# EasyEDA Pro project ProDoc_三路驱动V4.0_2025-09-29.epro

# Schematic Schematic4_3
Board Name: 三路驱动V4.0; Create Date: 2025-07-02; Page Name: P1; Project Name: 智能车竞赛2025; Schematic Name: Schematic4_3; Update Date: 2025-07-02; Company: 嘉立创EDA; Page Size: A4; Version: V1.0
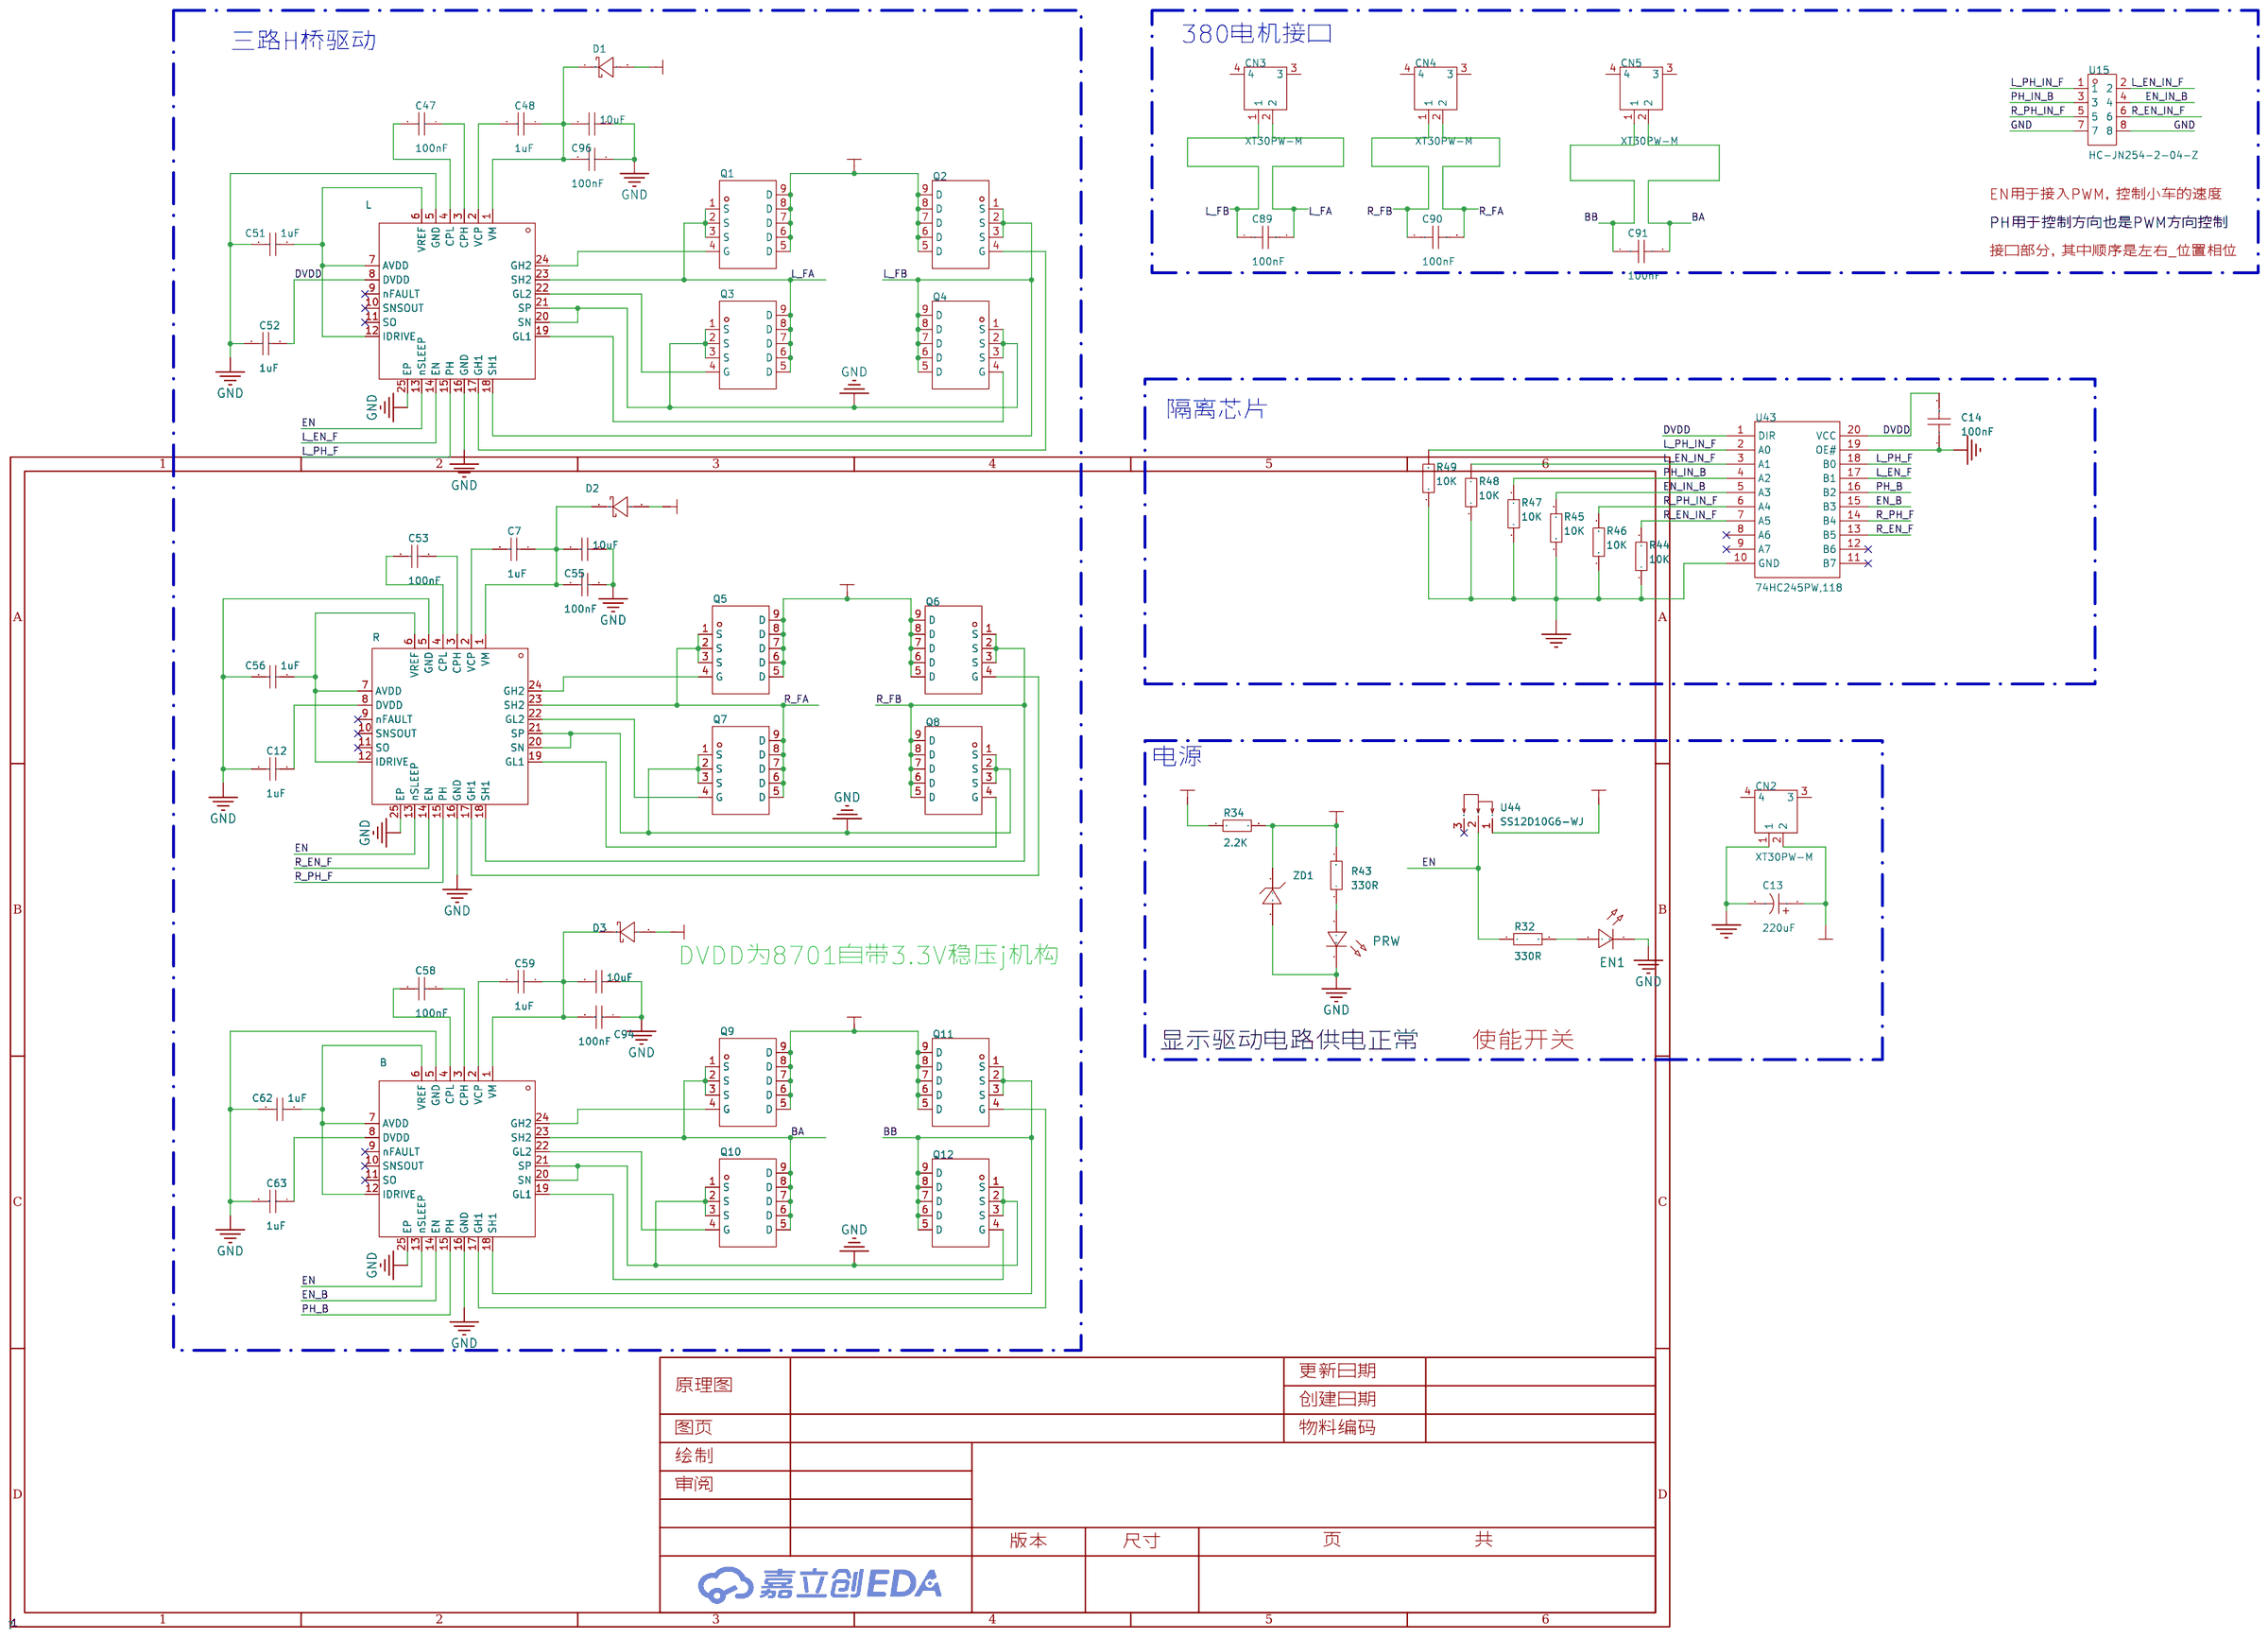
[diagram p0: schematic sheet]

## Parts
B  DRV8701ERGET  [VQFN-24_L4.0-W4.0-P0.50-LS4.0-BL-EP]
C7  1uF  [C0603]
C12  1uF  [C0603]
C13  220uF  [CAP-TH_BD8.0-P3.50-D0.5-FD]
C14  100nF  [C0603]
C47  100nF  [C0603]
C48  1uF  [C0603]
C51  1uF  [C0603]
C52  1uF  [c0603]
C53  100nF  [C0603]
C54  10uF  [C0603]
C55  100nF  [C0603]
C56  1uF  [C0603]
C58  100nF  [C0603]
C59  1uF  [C0603]
C62  1uF  [C0603]
C63  1uF  [C0603]
C89  100nF  [C0805]
C90  100nF  [C0805]
C91  100nF  [C0805]
C93  10uF  [C0603]
C94  100nF  [C0603]
C95  10uF  [C0603]
C96  100nF  [C0603]
CN2  XT30PW-M  [CONN-TH_XT30PW-M]
CN3  XT30PW-M  [CONN-TH_XT30PW-M]
CN4  XT30PW-M  [CONN-TH_XT30PW-M]
CN5  XT30PW-M  [CONN-TH_XT30PW-M]
D1  1N5819WS  [SOD-323_L1.6-W1.3-LS2.7-RD]
D2  1N5819WS  [SOD-323_L1.6-W1.3-LS2.7-RD]
D3  1N5819WS  [SOD-323_L1.6-W1.3-LS2.7-RD]
EN1  -  [LED0805-RD_BLUE]
L  DRV8701ERGET  [VQFN-24_L4.0-W4.0-P0.50-LS4.0-BL-EP]
PRW  -  [LED0805-RD_BLUE]
Q1  TPH1R403NL  [DSOP-8_L5.0-W5.0-P1.27-LS6.0-BL-EP]
Q2  TPH1R403NL  [DSOP-8_L5.0-W5.0-P1.27-LS6.0-BL-EP]
Q3  TPH1R403NL  [DSOP-8_L5.0-W5.0-P1.27-LS6.0-BL-EP]
Q4  TPH1R403NL  [DSOP-8_L5.0-W5.0-P1.27-LS6.0-BL-EP]
Q5  TPH1R403NL  [DSOP-8_L5.0-W5.0-P1.27-LS6.0-BL-EP]
Q6  TPH1R403NL  [DSOP-8_L5.0-W5.0-P1.27-LS6.0-BL-EP]
Q7  TPH1R403NL  [DSOP-8_L5.0-W5.0-P1.27-LS6.0-BL-EP]
Q8  TPH1R403NL  [DSOP-8_L5.0-W5.0-P1.27-LS6.0-BL-EP]
Q9  TPH1R403NL  [DSOP-8_L5.0-W5.0-P1.27-LS6.0-BL-EP]
Q10  TPH1R403NL  [DSOP-8_L5.0-W5.0-P1.27-LS6.0-BL-EP]
Q11  TPH1R403NL  [DSOP-8_L5.0-W5.0-P1.27-LS6.0-BL-EP]
Q12  TPH1R403NL  [DSOP-8_L5.0-W5.0-P1.27-LS6.0-BL-EP]
R  DRV8701ERGET  [VQFN-24_L4.0-W4.0-P0.50-LS4.0-BL-EP]
R32  330R  [R0805]
R34  2.2K  [R0805]
R43  330R  [R0805]
R44  10K  [R0603]
R45  10K  [R0603]
R46  10K  [R0603]
R47  10K  [R0603]
R48  10K  [R0603]
R49  10K  [R0603]
U15  HC-JN254-2-04-Z  [IDC-TH_8P-P2.54-V-R2-C4-S2.54]
U43  74HC245PW,118  [TSSOP-20_L6.5-W4.4-P0.65-LS6.4-BL]
U44  SS12D10G6-WJ  [SW-TH_3P-P4.80_HX-SS12D10G6-WJ]
ZD1  BZT52C3V3  [SOD-123_L2.8-W1.8-LS3.7-RD]

## Library data of the parts
B L R = DRV8701ERGET: DRV8701 DRV8701 H 桥栅极驱动器; Supplier Part: C132049; Manufacturer: TI(德州仪器); Supplier Footprint: VQFN-24; JLCPCB Part Class: 扩展库; Datasheet: https://atta.szlcsc.com/upload/public/pdf/source/20170925/C132049_1506321643935990409.pdf; Supplier: LCSC
C7 C12 C47 C48 C51-C56 C58 C59 C62 C63 C93-C96 = CC0805KRX7R9BB104: 容值:100nF;精度:±10%;额定电压:50V;温度系数:X7R;; LCSC Part Name: 100nF ±10% 50V; Supplier Part: C49678; Manufacturer: YAGEO(国巨); Supplier Footprint: 0805; JLCPCB Part Class: Basic Part; Datasheet: https://atta.szlcsc.com/upload/public/pdf/source/20151026/1457707504898.pdf; Supplier: LCSC; Tolerance: ±10%; Voltage Rated: 50V; Temperature Coefficient: X7R
C13 = 01EC1230: 容值:220uF;精度:±20%;额定电压:35V;纹波电流:280mA@120kHz;等效串联电阻:-;; LCSC Part Name: 220uF ±20% 35V; Supplier Part: C2831783; Manufacturer: KNSCHA(科尼盛); Supplier Footprint: 插件,D8xL12mm; JLCPCB Part Class: 扩展库; Datasheet: https://atta.szlcsc.com/upload/public/pdf/source/20210507/C2831783_57665407C268EE999E0BAC2FD481F51A.pdf; Supplier: LCSC; Tolerance: ±20%; Rated Voltage: 35V; Ripple Current: 280mA@120kHz; Lead Spacing: 3.5mm; φD: 8mm; L: 12mm; Lifetime @ Temp: 2000hrs@105℃; Operating Temperature: -40℃~+105℃
C14 = CAP_0603: Supplier Footprint: 0603
C89-C91 = CAP_0805: Supplier Footprint: 0805
CN2-CN5 = XT30PW-M: 类别:-;类型1:-;; LCSC Part Name: AMASS(艾迈斯)航模插头 卧式弯脚 XT30PW-M公头; Supplier Part: C431092; Manufacturer: AMASS(艾迈斯); JLCPCB Part Class: 扩展库; Datasheet: https://atta.szlcsc.com/upload/public/pdf/source/20220222/6A9F22F7850E25B33E1BE430ADF8560B.pdf; Supplier: LCSC; Brand: 艾迈斯; Type: 航模插头; RatedVoltage: DC 500V; InterfaceType: 公头; RatedCurrent: 15A; RecommendedWireGauge: 16/18/20AWG; contact resistance: 1.2mΩ; specifications: 2pin
D1-D3 = 1N5819WS_C1884554: 二极管配置:独立式;直流反向耐压(Vr):40V;平均整流电流(Io):-;正向压降(Vf):600mV@200mA;反向电流(Ir):5A@30V;; LCSC Part Name: 40V 600mV@200mA; Supplier Part: C1884554; Manufacturer: YFW佑风微; Supplier Footprint: SOD-323; JLCPCB Part Class: 扩展库; Datasheet: https://atta.szlcsc.com/upload/public/pdf/source/20210111/C1884554_4EBD9497399E51FFCDCB2BD4F6DDA6EC.pdf; Supplier: LCSC; Diode Configuration: 独立式; Reverse Voltage (Vr): 40V; Forward Voltage (Vf@If): 600mV@200mA; Reverse Leakage Current (Ir): 5A@30V
EN1 PRW = LED_0603-R: 发光颜色:红灯;二极管配置:-;透镜颜色:无色透明;主波长:617.5nm;峰值波长:632nm;色温:-;光通量(25时):-;测试电流:5mA;正向电压(VF):2.2V;发光强度:28.5mcd;功率:60mW;发光角度:120°;安装方式:-;工作温度:-40~+85;; Supplier Footprint: 0603; Supplier Part: C72044
Q1-Q12 = TPH1R403NL_C83440: 类型:N沟道;漏源电压(Vdss):30V;连续漏极电流(Id):150A;功率(Pd):64W;导通电阻(RDS(on)@Vgs,Id):1.4mΩ@10V,30A;阈值电压(Vgs(th)@Id):2.3V@500A;; LCSC Part Name: N沟道 30V 150A; Supplier Part: C83440; Manufacturer: TOSHIBA(东芝); Supplier Footprint: SOP Advance; JLCPCB Part Class: 扩展库; Datasheet: https://atta.szlcsc.com/upload/public/pdf/source/20170908/C83440_1504870121708958077.pdf; Supplier: LCSC; Type: N沟道; Drain Source Voltage (Vdss): 30V; Continuous Drain Current (Id): 150A; Power Dissipation (Pd): 64W; Drain Source On Resistance (RDS(on)@Vgs,Id): 1.4mΩ@10V,30A; Gate Threshold Voltage (Vgs(th)@Id): 2.3V@500A
R32 R34 R43-R49 = Res_0603: Supplier Footprint: 0603
U15 = HC-JN254-2-04-Z: 连接器类型:简牛座;间距:2.54mm;结构:2x4P;额定电流:3A;额定电压:-;封装形式:直插;行距:2.54mm;排数:2;每排PIN数:4;触头材质:黄铜;触头镀层:金;工作温度范围:-40℃~+105℃;焊接温度(最大值):260℃@10S;; LCSC Part Name: 2.54mm 2x4P 排数:2 每排P数:4; Supplier Part: C5372864; Manufacturer: HCTL(华灿天禄); Supplier Footprint: 插件,P=2.54mm; JLCPCB Part Class: 扩展库; Datasheet: https://atta.szlcsc.com/upload/public/pdf/source/20230314/29278A24539954283B80828B9C32CD4C.pdf; Supplier: LCSC; Connector Type: 简牛座; Pitch: 2.54mm; Structure: 2x4P; Current Rating (Max): 3A; Holder Type: 直插; Row Spacing: 2.54mm; Number of Rows: 2; Pin Number in each Row: 4; Contact Material: 黄铜; Contact Plating: 金; Operating Temperature Range: -40℃~+105℃; Soldering Temperature(Max): 260℃@10S
U43 = 74HC245PW,118: 输入类型:-;电源电压:2V~6V;元件数:1;每个元件位数:8;灌电流(IOL):7.8mA;拉电流(IOH):7.8mA;; Supplier Part: C5626; Manufacturer: Nexperia(安世); Supplier Footprint: TSSOP-20; JLCPCB Part Class: 扩展库; Datasheet: https://atta.szlcsc.com/upload/public/pdf/source/20240724/EDC8C45902BA97AEC59E8811E3964917.pdf; Supplier: LCSC; output type: 三态; Supply Voltage: 2V~6V; Number of Elements: 1; Number of Bits per Element: 8; Sink Current: 7.8mA; Source Current: 7.8mA; Logic Family: 74HC; Operating Temperature: -40℃~+125℃
U44 = SS12D10G6-WJ: 电路结构:单刀双掷;安装方式:弯插;开关颜色:黑色;额定电流:2A;额定电压:125V;工作寿命:3千次;; LCSC Part Name: 两档卧式插件 3脚拨动开关弯插 柄长6.0mm; Supplier Part: C7431059; Manufacturer: SHOU HAN(首韩); Supplier Footprint: 插件; JLCPCB Part Class: 扩展库; Datasheet: https://atta.szlcsc.com/upload/public/pdf/source/20240716/65906E925F6A30FB5BD71C0F2E575DBB.pdf; Supplier: LCSC; Circuit: 单刀双掷; Actuator Style: 矩形柱状; Termination Style: PC引脚; Length: 12.7mm; Width: 6.7mm; Switch Height: 12.4mm; Mounting Type: 弯插; Actuator Color: 黑色; Current Rating: 2A; Voltage Rating: 125V; Life: 3千次; Operating Temperature: -25℃~+70℃
ZD1 = BZT52C3V3_C2112: 二极管配置:独立式;稳压值(标称值):3.3V;稳压值(范围):3.1V~3.5V;精度:-;功率:350mW;反向电流(Ir):5A@1V;阻抗(Zzt):95Ω;; LCSC Part Name: 3.3V 350mW; Supplier Part: C2112; Manufacturer: CJ（江苏长电/长晶）; Supplier Footprint: SOD-123; JLCPCB Part Class: 扩展库; Datasheet: https://atta.szlcsc.com/upload/public/pdf/source/20170919/C2112_1505799672426977594.pdf; Supplier: LCSC; Diode Configuration: 独立式; Zener Voltage (Nom): 3.3V; Zener Voltage (Range): 3.1V~3.5V; Power Dissipation: 350mW; Reverse Leakage Current (Ir): 5A@1V; Zener Impedance (Zzt): 95Ω

## Nets
3.3V: R34.2 R43.2 U44.1 ZD1.1(K)
DVDD: C14.2 C52.1 L.8(DVDD) U43.1(DIR) U43.20(VCC)
GND: B.5(GND) B.16(GND) B.20(SN) B.21(SP) B.25(EP) C12.2 C13.2 C14.1 C51.2 C52.2 C54.1 C55.1 C56.2 C62.2 C63.2 C93.1 C94.1 C95.1 C96.1 CN2.1 EN1.1(C) L.5(GND) L.16(GND) L.20(SN) L.21(SP) L.25(EP) PRW.1(C) Q3.1(S) Q3.2(S) Q3.3(S) Q4.1(S) Q4.2(S) Q4.3(S) Q7.1(S) Q7.2(S) Q7.3(S) Q8.1(S) Q8.2(S) Q8.3(S) Q10.1(S) Q10.2(S) Q10.3(S) Q12.1(S) Q12.2(S) Q12.3(S) R.5(GND) R.16(GND) R.20(SN) R.21(SP) R.25(EP) R44.1 R45.1 R46.1 R47.1 R48.1 R49.1 U15.7 U15.8 U43.10(GND) U43.19(OE#) ZD1.2(A)
VIN: C13.1 CN2.2 D1.2(A) D2.2(A) D3.2(A) Q1.5(D) Q1.6(D) Q1.7(D) Q1.8(D) Q1.9(D) Q2.5(D) Q2.6(D) Q2.7(D) Q2.8(D) Q2.9(D) Q5.5(D) Q5.6(D) Q5.7(D) Q5.8(D) Q5.9(D) Q6.5(D) Q6.6(D) Q6.7(D) Q6.8(D) Q6.9(D) Q9.5(D) Q9.6(D) Q9.7(D) Q9.8(D) Q9.9(D) Q11.5(D) Q11.6(D) Q11.7(D) Q11.8(D) Q11.9(D) R34.1
BA: B.23(SH2) C91.2 CN5.2 Q9.1(S) Q9.2(S) Q9.3(S) Q10.5(D) Q10.6(D) Q10.7(D) Q10.8(D) Q10.9(D)
BB: B.18(SH1) C91.1 CN5.1 Q11.1(S) Q11.2(S) Q11.3(S) Q12.5(D) Q12.6(D) Q12.7(D) Q12.8(D) Q12.9(D)
EN: B.13(nSLEEP) L.13(nSLEEP) R.13(nSLEEP) R32.1 U44.2
EN_B: B.14(EN) U43.15(B3)
EN_IN_B: R45.2 U15.4 U43.5(A3)
L_EN_F: L.14(EN) U43.17(B1)
L_EN_IN_F: R48.2 U15.2 U43.3(A1)
L_FA: C89.2 CN3.2 L.23(SH2) Q1.1(S) Q1.2(S) Q1.3(S) Q3.5(D) Q3.6(D) Q3.7(D) Q3.8(D) Q3.9(D)
L_FB: C89.1 CN3.1 L.18(SH1) Q2.1(S) Q2.2(S) Q2.3(S) Q4.5(D) Q4.6(D) Q4.7(D) Q4.8(D) Q4.9(D)
L_PH_F: L.15(PH) U43.18(B0)
L_PH_IN_F: R49.2 U15.1 U43.2(A0)
PH_B: B.15(PH) U43.16(B2)
PH_IN_B: R47.2 U15.3 U43.4(A2)
R_EN_F: R.14(EN) U43.13(B5)
R_EN_IN_F: R44.2 U15.6 U43.7(A5)
R_FA: C90.2 CN4.2 Q5.1(S) Q5.2(S) Q5.3(S) Q7.5(D) Q7.6(D) Q7.7(D) Q7.8(D) Q7.9(D) R.23(SH2)
R_FB: C90.1 CN4.1 Q6.1(S) Q6.2(S) Q6.3(S) Q8.5(D) Q8.6(D) Q8.7(D) Q8.8(D) Q8.9(D) R.18(SH1)
R_PH_F: R.15(PH) U43.14(B4)
R_PH_IN_F: R46.2 U15.5 U43.6(A4)
$1N4660: L.22(GL2) Q3.4(G)
$1N4661: L.24(GH2) Q1.4(G)
$1N4662: C48.2 L.2(VCP)
$1N4663: C47.2 L.4(CPL)
$1N4675: C51.1 L.6(VREF) L.7(AVDD) L.12(IDRIVE)
$1N4676: C47.1 L.3(CPH)
$1N4680: L.19(GL1) Q4.4(G)
$1N4681: L.17(GH1) Q2.4(G)
$1N4684: C7.2 R.2(VCP)
$1N4685: C53.2 R.4(CPL)
$1N4694: C56.1 R.6(VREF) R.7(AVDD) R.12(IDRIVE)
$1N4695: C53.1 R.3(CPH)
$1N4699: Q8.4(G) R.19(GL1)
$1N4700: Q6.4(G) R.17(GH1)
$1N4703: C12.1 R.8(DVDD)
$1N4708: B.22(GL2) Q10.4(G)
$1N4709: B.24(GH2) Q9.4(G)
$1N4710: B.2(VCP) C59.2
$1N4711: B.4(CPL) C58.2
$1N4721: B.8(DVDD) C63.1
$1N4722: B.6(VREF) B.7(AVDD) B.12(IDRIVE) C62.1
$1N4723: B.3(CPH) C58.1
$1N4727: B.19(GL1) Q12.4(G)
$1N4728: B.17(GH1) Q11.4(G)
$1N4802: Q5.4(G) R.24(GH2)
$1N4803: Q7.4(G) R.22(GL2)
$1N4806: EN1.2(A) R32.2
$1N4831: B.1(VM) C59.1 C93.2 C94.2 D3.1(C)
$1N4840: C48.1 C95.2 C96.2 D1.1(C) L.1(VM)
$1N4841: C7.1 C54.2 C55.2 D2.1(C) R.1(VM)
$1N5410: PRW.2(A) R43.1

Not connected (* = marked no-connect by the designer): B 9(nFAULT)* 10(SNSOUT)* 11(SO)*; CN2 3 4; CN3 3 4; CN4 3 4; CN5 3 4; L 9(nFAULT)* 10(SNSOUT)* 11(SO)*; R 9(nFAULT)* 10(SNSOUT)* 11(SO)*; U43 8(A6)* 9(A7)* 11(B7)* 12(B6)*; U44 3*

## Notes on the sheet
- 380电机接口
- 三路H桥驱动
- EN用于接入PWM，控制小车的速度
- PH用于控制方向也是PWM方向控制
- 接口部分，其中顺序是左右_位置相位
- 隔离芯片
- 电源
- DVDD为8701自带3.3V稳压j机构
- 显示驱动电路供电正常
- 使能开关

# Board PCB5_3
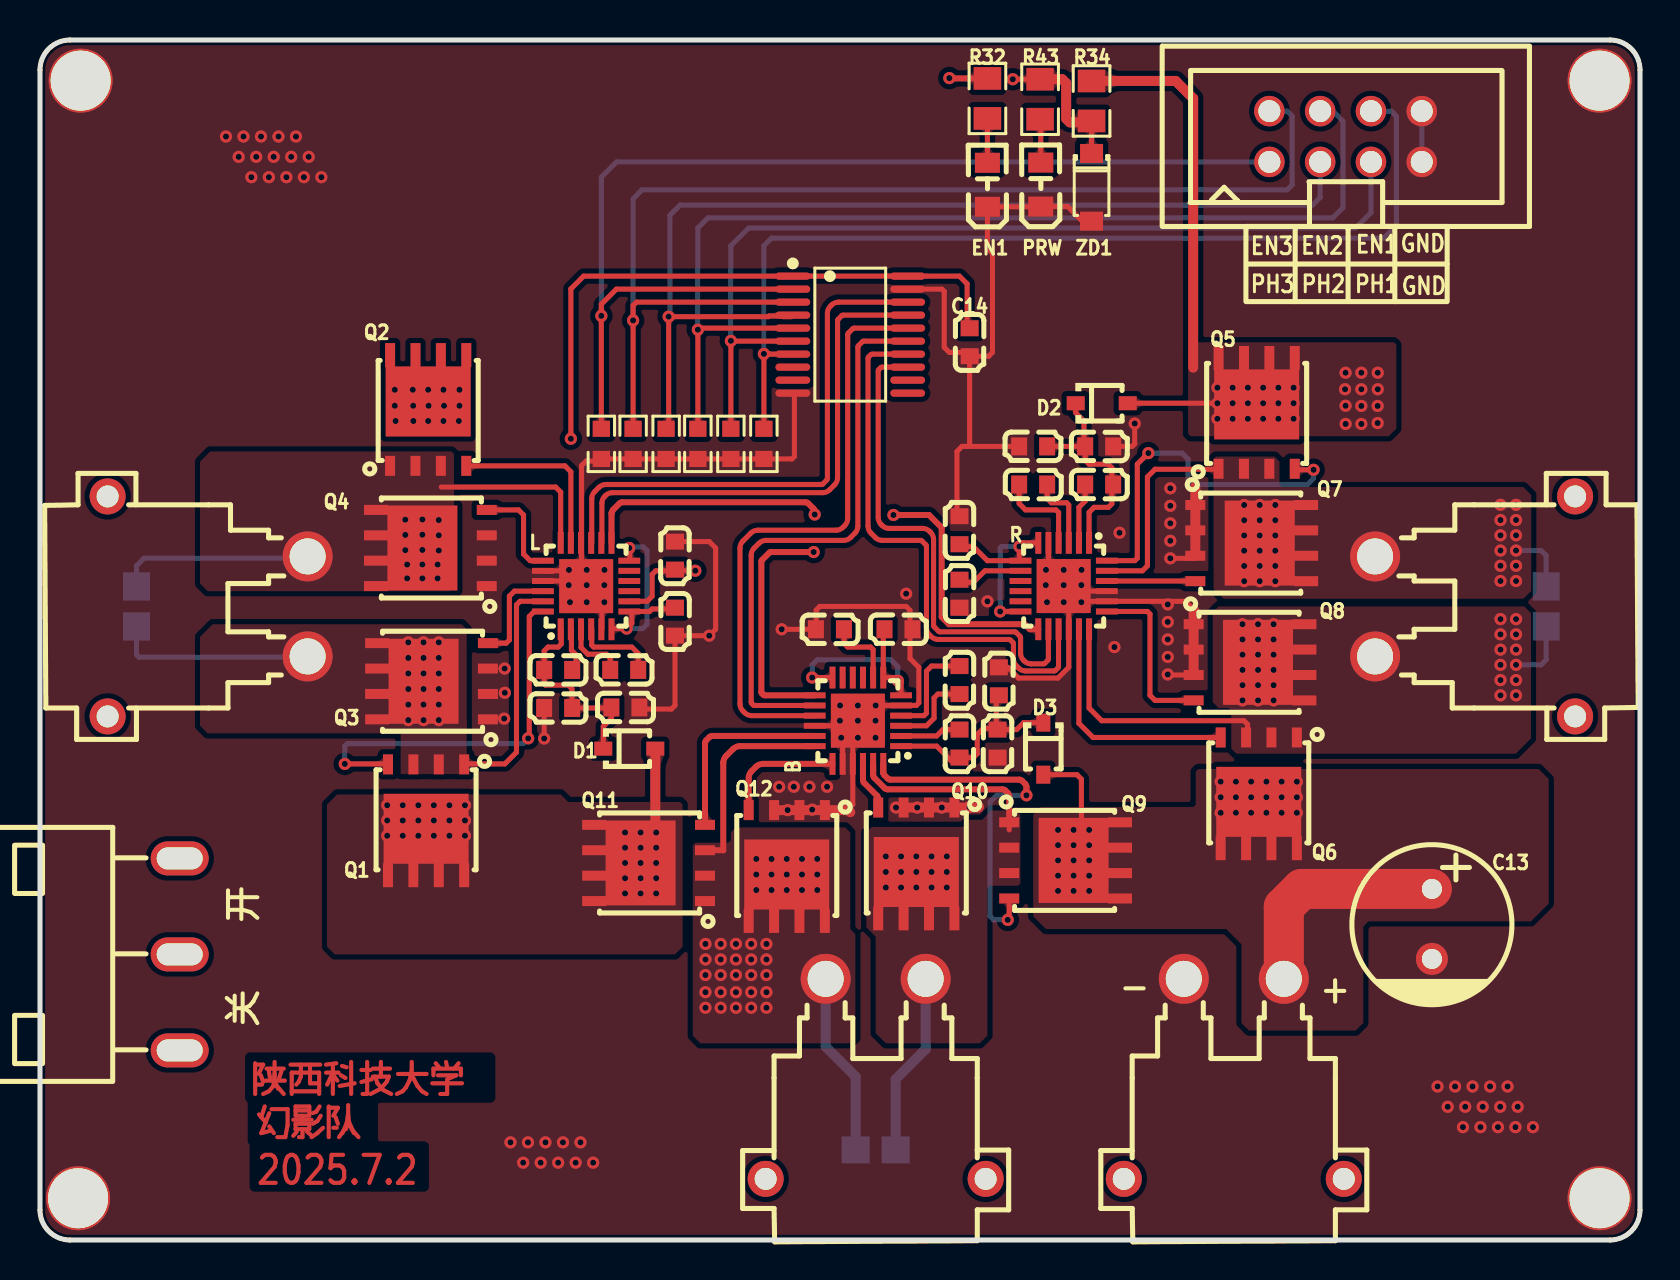
[diagram p1: board, top side]
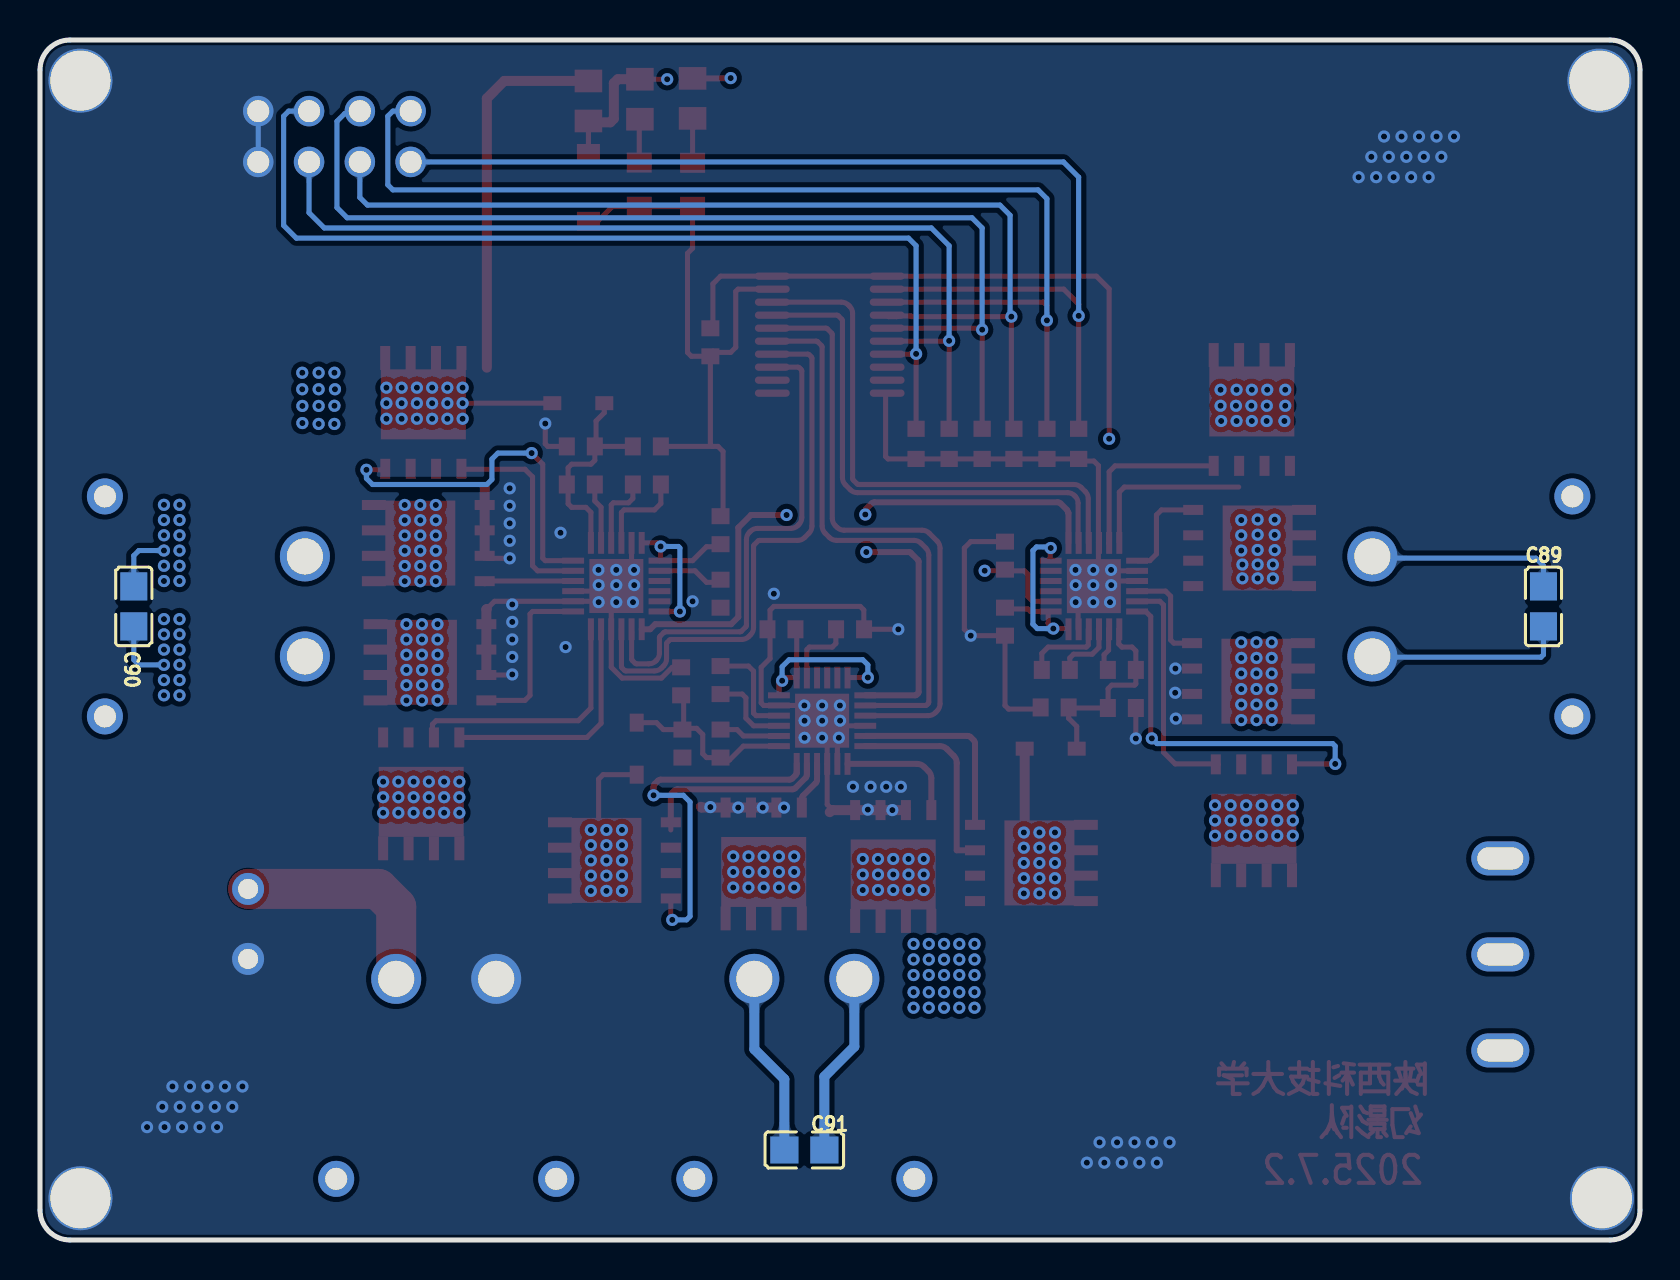
[diagram p2: board, bottom side, seen from below]

Outline 80 x 60 mm; copper layers: Top Layer, Inner1, Inner2, Bottom Layer. Coordinates in mm from the lower left corner of the outline.
Outline path: 0,58.5 0,1.5 arc(0.44,0.44) 1.5,0 78.5,0 arc(79.56,0.44) 80,1.5 80,58.5 arc(79.56,59.56) 78.5,60 1.5,60 arc(0.44,59.56) 0,58.5
Stack: Top Layer 0.035mm 外层铜厚1oz / Dielectric1 0.2104mm 7628 RC49% 8.6mil / Inner1 0.0152mm 内层铜厚 / Dielectric2 1.065mm 1.1mm H/HOZ Copper / Inner2 0.0152mm 内层铜厚 / Dielectric3 0.2104mm 7628 RC49% 8.6mil / Bottom Layer 0.035mm 外层铜厚1oz

## Design rules (mm)
template: 自定义配置
spacing copperThickness1oz (default): track to track 0.102, other pairs 0.152 to 0.3
spacing copperThickness2oz: track to track 0.203, other pairs 0.152 to 0.3
track width copperThickness1oz (default): min 0.127, default 0.254, max 5
track width copperThickness2oz: min 0.203, default 0.254, max 2.54
differential pair differentialPair (default): width min 0.127, default 0.254, max 2.54; gap min 0.152, default 0.152
via viaSize (default): diameter min 0.5, default 0.61, max 10; hole min 0.3, default 0.305, max 6.3

## Placement (name value [footprint] x y rotation side)
B  DRV8701ERGET  [VQFN-24_L4.0-W4.0-P0.50-LS4.0-BL-EP]  40.89 25.96 90 top
C7  1uF  [C0603]  52.96 37.78 180 top
C12  1uF  [C0603]  45.97 32.31 270 top
C13  220uF  [CAP-TH_BD8.0-P3.50-D0.5-FD]  69.6 15.8 270 top
C14  100nF  [C0603]  46.48 44.89 90 top
C47  100nF  [C0603]  29.21 28.5 0 top
C48  1uF  [C0603]  25.91 28.5 0 top
C51  1uF  [C0603]  31.75 30.92 270 top
C52  1uF  [c0603]  31.75 34.22 90 top
C53  100nF  [C0603]  49.66 37.78 180 top
C54  10uF  [C0603]  49.66 39.68 0 top
C55  100nF  [C0603]  52.96 39.68 180 top
C56  1uF  [C0603]  45.97 35.49 90 top
C58  100nF  [C0603]  45.97 28 90 top
C59  1uF  [C0603]  45.97 24.82 90 top
C62  1uF  [C0603]  42.93 30.54 0 top
C63  1uF  [C0603]  39.5 30.54 180 top
C89  100nF  [C0805]  4.83 31.68 270 bottom
C90  100nF  [C0805]  75.31 31.68 90 bottom
C91  100nF  [C0805]  41.78 4.5 0 bottom
C93  10uF  [C0603]  47.94 27.93 270 top
C94  100nF  [C0603]  47.88 24.82 90 top
C95  10uF  [C0603]  25.91 26.6 0 top
C96  100nF  [C0603]  29.27 26.63 180 top
CN2  XT30PW-M  [CONN-TH_XT30PW-M]  59.69 8.06 0 top
CN3  XT30PW-M  [CONN-TH_XT30PW-M]  8.38 31.68 270 top
CN4  XT30PW-M  [CONN-TH_XT30PW-M]  71.75 31.68 90 top
CN5  XT30PW-M  [CONN-TH_XT30PW-M]  41.78 8.06 0 top
D1  1N5819WS  [SOD-323_L1.6-W1.3-LS2.7-RD]  29.46 24.57 0 top
D2  1N5819WS  [SOD-323_L1.6-W1.3-LS2.7-RD]  53.09 41.84 0 top
D3  1N5819WS  [SOD-323_L1.6-W1.3-LS2.7-RD]  50.16 24.57 270 top
EN1  -  [LED0805-RD_BLUE]  47.37 52.76 90 top
L  DRV8701ERGET  [VQFN-24_L4.0-W4.0-P0.50-LS4.0-BL-EP]  27.31 32.69 0 top
NOREF  -  [Pad_e255]  77.98 57.97 0 top
NOREF#2  -  [Pad_e259]  2.03 57.97 0 top
NOREF#3  -  [Pad_e257]  77.98 2.09 0 top
NOREF#4  -  [Pad_e258]  1.91 2.09 0 top
PRW  -  [LED0805-RD_BLUE]  50.04 52.77 90 top
Q1  TPH1R403NL  [DSOP-8_L5.0-W5.0-P1.27-LS6.0-BL-EP]  19.3 21.01 180 top
Q2  TPH1R403NL  [DSOP-8_L5.0-W5.0-P1.27-LS6.0-BL-EP]  19.41 41.48 0 top
Q3  TPH1R403NL  [DSOP-8_L5.0-W5.0-P1.27-LS6.0-BL-EP]  19.63 27.94 90 top
Q4  TPH1R403NL  [DSOP-8_L5.0-W5.0-P1.27-LS6.0-BL-EP]  19.57 34.6 90 top
Q5  TPH1R403NL  [DSOP-8_L5.0-W5.0-P1.27-LS6.0-BL-EP]  60.83 41.33 0 top
Q6  TPH1R403NL  [DSOP-8_L5.0-W5.0-P1.27-LS6.0-BL-EP]  60.94 22.36 180 top
Q7  TPH1R403NL  [DSOP-8_L5.0-W5.0-P1.27-LS6.0-BL-EP]  60.54 34.85 270 top
Q8  TPH1R403NL  [DSOP-8_L5.0-W5.0-P1.27-LS6.0-BL-EP]  60.45 28.89 270 top
Q9  TPH1R403NL  [DSOP-8_L5.0-W5.0-P1.27-LS6.0-BL-EP]  51.23 18.98 270 top
Q10  TPH1R403NL  [DSOP-8_L5.0-W5.0-P1.27-LS6.0-BL-EP]  43.81 18.85 180 top
Q11  TPH1R403NL  [DSOP-8_L5.0-W5.0-P1.27-LS6.0-BL-EP]  30.48 18.85 90 top
Q12  TPH1R403NL  [DSOP-8_L5.0-W5.0-P1.27-LS6.0-BL-EP]  37.34 18.72 180 top
R  DRV8701ERGET  [VQFN-24_L4.0-W4.0-P0.50-LS4.0-BL-EP]  51.18 32.7 180 top
R32  330R  [R0805]  47.37 57.08 270 top
R34  2.2K  [R0805]  52.58 56.95 270 top
R43  330R  [R0805]  50 57.04 90 top
R44  10K  [R0603]  36.19 39.81 90 top
R45  10K  [R0603]  32.89 39.81 90 top
R46  10K  [R0603]  34.54 39.81 90 top
R47  10K  [R0603]  31.31 39.81 90 top
R48  10K  [R0603]  29.65 39.81 90 top
R49  10K  [R0603]  28.07 39.81 90 top
U15  HC-JN254-2-04-Z  [IDC-TH_8P-P2.54-V-R2-C4-S2.54]  65.28 55.17 0 top
U43  74HC245PW,118  [TSSOP-20_L6.5-W4.4-P0.65-LS6.4-BL]  40.51 45.27 270 top
U44  SS12D10G6-WJ  [SW-TH_3P-P4.80_HX-SS12D10G6-WJ]  6.98 14.28 270 top
ZD1  BZT52C3V3  [SOD-123_L2.8-W1.8-LS3.7-RD]  52.58 52.63 270 top

## Footprints (pads in the part's own frame, mm; a bottom-side part is the same pattern mirrored in y, then rotated)
c0603
  rect 0.8x0.9 smd: 1(-0.7,0) 2(0.7,0)
C0603
  rect 0.8x0.9 smd: 1(-0.7,0) 2(0.7,0)
C0805
  rect 1.41x1.35 smd: 1(-1,0) 2(1,0)
CAP-TH_BD8.0-P3.50-D0.5-FD
  round 1.6 hole 1: 1(-1.75,0) 2(1.75,0)
CONN-TH_XT30PW-M
  round 2.5 hole 1.8: 1(-2.5,5) 2(2.5,5)
  round 1.8 hole 1.1: 3(5.5,-5) 4(-5.5,-5)
DSOP-8_L5.0-W5.0-P1.27-LS6.0-BL-EP
  rect 0.5x1 smd: 1(-1.905,-2.77) 2(-0.635,-2.77) 3(0.634,-2.77) 4(1.905,-2.77)
  rect 0.5x1.2 smd: 5(1.905,2.77) 6(0.635,2.77) 7(-0.634,2.77) 8(-1.905,2.77)
  custom 4.25x3.5 smd: 9(0,0.45)
IDC-TH_8P-P2.54-V-R2-C4-S2.54
  round 1.524 hole 1.1: 1(-3.81,-1.27) 2(-3.81,1.27) 3(-1.27,-1.27) 4(-1.27,1.27) 5(1.27,-1.27) 6(1.27,1.27) 7(3.81,-1.27) 8(3.81,1.27)
LED0805-RD_BLUE
  rect 1x1.25 smd: 1(-1.1,0) 2(1.1,0)
Pad_e255
  round 3.2 hole 3: 1(0,0)
Pad_e257
  round 3.2 hole 3: 1(0,0)
Pad_e258
  round 3.2 hole 3: 1(0,0)
Pad_e259
  round 3.2 hole 3: 1(0,0)
R0603
  rect 0.806x0.864 smd: 1(-0.753,0) 2(0.753,0)
R0805
  rect 1.133x1.377 smd: 1(-1,0) 2(1,0)
SOD-123_L2.8-W1.8-LS3.7-RD
  rect 0.95x1.15 smd: 1(-1.692,0) 2(1.692,0)
SOD-323_L1.6-W1.3-LS2.7-RD
  rect 0.899x0.701 smd: 1(-1.3,0) 2(1.3,0)
SW-TH_3P-P4.80_HX-SS12D10G6-WJ
  oval 1.7x2.9 hole 1.1x2.3: 1(-4.8,0) 2(0,0) 3(4.8,0)
TSSOP-20_L6.5-W4.4-P0.65-LS6.4-BL
  oval 0.364x1.742 smd: 1(-2.925,-2.871) 2(-2.275,-2.871) 3(-1.625,-2.871) 4(-0.975,-2.871) 5(-0.325,-2.871) 6(0.325,-2.871) 7(0.975,-2.871) 8(1.625,-2.871) 9(2.275,-2.871) 10(2.925,-2.871) 11(2.925,2.871) 12(2.275,2.871) 13(1.625,2.871) 14(0.975,2.871) 15(0.325,2.871) 16(-0.325,2.871) 17(-0.975,2.871) 18(-1.625,2.871) 19(-2.275,2.871) 20(-2.925,2.871)
VQFN-24_L4.0-W4.0-P0.50-LS4.0-BL-EP
  rect 0.3x1.092 smd: 1(-1.27,-2.159) 2(-0.762,-2.159) 3(-0.254,-2.159) 4(0.254,-2.159) 5(0.762,-2.159) 6(1.27,-2.159) 13(1.27,2.159) 14(0.762,2.159) 15(0.254,2.159) 16(-0.254,2.159) 17(-0.762,2.159) 18(-1.27,2.159)
  rect 1.092x0.3 smd: 7(2.159,-1.27) 8(2.159,-0.762) 9(2.159,-0.254) 10(2.159,0.254) 11(2.159,0.762) 12(2.159,1.27) 19(-2.159,1.27) 20(-2.159,0.762) 21(-2.159,0.254) 22(-2.159,-0.254) 23(-2.159,-0.762) 24(-2.159,-1.27)
  rect 2.7x2.7 smd: 25(0.001,-0.002)

## Nets
As in the schematic, except:
GND: B.5 B.16 B.20 B.21 B.25 C12.2 C13.2 C14.1 C51.2 C52.2 C54.1 C55.1 C56.2 C62.2 C63.2 C93.1 C94.1 C95.1 C96.1 CN2.1 EN1.1 L.5 L.16 L.20 L.21 L.25 NOREF.1 NOREF#2.1 NOREF#3.1 NOREF#4.1 PRW.1 Q3.1 Q3.2 Q3.3 Q4.1 Q4.2 Q4.3 Q7.1 Q7.2 Q7.3 Q8.1 Q8.2 Q8.3 Q10.1 Q10.2 Q10.3 Q12.1 Q12.2 Q12.3 R.5 R.16 R.20 R.21 R.25 R44.1 R45.1 R46.1 R47.1 R48.1 R49.1 U15.7 U15.8 U43.10 U43.19 ZD1.2

Pads without a net: B 9 10 11; CN2 3 4; CN3 3 4; CN4 3 4; CN5 3 4; L 9 10 11; R 9 10 11; U43 8 9 11 12; U44 3

## Via types
v1: diameter 0.61, hole 0.305, Top Layer to Bottom Layer, 382 vias

## Routing (per net, layer and track width the routed paths; a pad name or vN(x,y) marks a point on that pad's centre or on a via; arc(x,y) is an arc through that point)
3.3V: length 89
  Top Layer w0.254: R34.2 ZD1.1 ; R43.2 v1(48.64,58.04)
  Top Layer w0.5: R43.2 51.11,58.04 51.31,57.84 51.31,56.06 51.49,55.88 52.51,55.88 R34.2
  Inner1 w0.254: U44.1 7.24,19.33 7.24,58.09 8,58.86 48.39,58.86 48.64,58.6 v1(48.64,58.04)
DVDD: length 46.9
  Top Layer w0.254: 46.35,45.84 46.35,47.81 45.97,48.19 U43.20 U43.1 27.18,48.19 26.54,47.55 v1(26.54,40.06) ; 29.49,31.94 30.36,31.94 30.61,32.19 30.61,33.28 30.79,33.46 31.69,33.46 31.75,33.52 31.81,33.46 v1(32.77,33.46)
  Inner1 w0.254: v1(26.54,40.06) 32.38,40.06 32.77,39.68 v1(32.77,33.46)
GND: length 139.7
  Top Layer w0.254: R.5 50.42,33.46 R.25 ; ZD1.2 52.11,50.94 51.38,51.67 PRW.1 50.03,51.66 EN1.1 47.37,49.59 47.62,49.33 47.62,44.38 47.43,44.19 C14.1 46.48,39.77 46.39,39.68 ; 27.08,32.95 27.08,38.72 27.31,38.95 27.96,38.95 R49.1 R48.1 R47.1 R45.1 R46.1 R44.1 37.6,39.05 37.72,39.17 37.72,42.27 U43.10 ; B.16 40.64,25.71 ; 26.79,31.89 v1(26.5,31.89) ; v1(52.08,33.51) 51.32,32.74 v1(51.19,32.74) ; C52.2 33.46,34.92 33.78,34.6 33.78,30.54 v1(33.46,30.22) C51.2 31.75,26.73 31.57,26.55 30.05,26.55 C96.1 ; 46.39,39.68 46.1,39.68 45.85,39.43 45.85,36.06 ; 46.39,39.68 48.96,39.68 ; 51.44,32.44 51.95,31.94 R.20 57.28,31.94 57.66,31.55 ; 51.44,32.44 R.16 51.44,28.64 50.9,28.1 48.93,28.1 48.39,28.63 C93.1 ; 51.44,32.44 R.21 ; C55.1 54.61,39.68 54.74,39.81 v1(54.74,40.82) ; B.20 40.13,25.04 v1(40.06,25.11) 40.35,25.11 40.64,24.82 B.21 40.64,21.77 40.36,21.5 ; 25.17,33.46 26.57,33.46 27.08,32.95 25.17,32.95 ; U43.19 45.1,47.54 45.21,47.43 45.21,44.63 45.47,44.38 46.29,44.38 46.35,44.44 ; 56.35,28.25 Q8.3 ; 27.33,32.7 28.09,31.94 28.09,30.54 ; v1(28.23,33.5) 27.47,32.74 27.34,32.74 ; Q7.3 57.64,34.08 v1(56.51,34.08) ; v1(37.08,30.54) 38.8,30.54 38.81,30.55 38.81,31.5 38.99,31.68 43.31,31.68 43.5,31.49 43.5,29.07 43.94,28.63 43.94,26.85 43.81,26.73 B.5 v1(41.78,26.73) 41.02,25.97 B.25 ; C95.1 v1(25.21,25.08) ; 50.64,31.89 v1(50.35,31.89) ; 46.46,21.62 v1(46.48,21.65)
  Top Layer w0.5: Q8.3 Q8.2 Q8.1 57.68,31.53 57.66,31.55 ; v1(42.8,21.62) Q10.3 v1(43.86,21.62) Q10.2 v1(45.09,21.62) Q10.1 46.91,21.62 46.95,21.66 ; 40.51,21.39 40.41,21.5 v1(37.38,21.5) 36.7,21.5 ; 57.77,37.65 Q7.1 Q7.2 Q7.3
  Bottom Layer w0.254: U15.8 U15.7
  vias: v1(9.3,55.17) v1(9.93,54.16) v1(10.17,55.17) v1(10.57,53.14) v1(10.81,54.16) v1(11.05,55.17) v1(11.44,53.14) v1(11.68,54.16) v1(11.92,55.17) v1(12.32,53.14) v1(12.56,54.16) v1(12.8,55.17) v1(13.19,53.14) v1(13.43,54.16) v1(14.07,53.14) v1(23.23,28.57) v1(23.24,27.36) v1(23.21,26.07) v1(23.52,4.88) v1(24.16,3.87) v1(24.4,4.88) v1(25.03,3.87) v1(25.27,4.88) v1(25.91,3.87) v1(26.15,4.88) v1(26.45,33.5) v1(26.44,32.74) v1(26.78,3.87) v1(27.02,4.88) v1(27.34,33.5) v1(27.34,32.74) v1(27.34,31.89) v1(27.66,3.87) v1(28.22,32.74) v1(28.22,31.89) v1(36.96,22.66) v1(37.69,22.66) v1(38.47,22.66) v1(38.61,21.52) v1(39.35,22.66) v1(40,26.73) v1(40,25.97) v1(40.89,26.73) v1(40.89,25.97) v1(40.89,25.11) v1(41.77,25.97) v1(41.77,25.11) v1(43.31,32.31) v1(47.37,31.93) v1(50.3,33.51) v1(50.29,32.74) v1(51.19,33.51) v1(51.19,31.89) v1(52.07,32.74) v1(52.07,31.89) v1(53.72,29.65) v1(53.97,35.36) v1(56.39,31.78) v1(56.39,30.9) v1(56.39,30.03) v1(56.39,29.15) v1(56.39,28.28) v1(56.51,37.58) v1(56.51,36.71) v1(56.51,35.83) v1(56.51,34.96) v1(69.88,7.68) v1(70.39,6.66) v1(70.75,7.68) v1(71.15,5.64) v1(71.26,6.66) v1(71.63,7.68) v1(72.02,5.64) v1(72.14,6.66) v1(72.5,7.68) v1(72.9,5.64) v1(73.01,6.66) v1(73.38,7.68) v1(73.77,5.64) v1(73.89,6.66) v1(74.65,5.64)
VIN: length 161
  Top Layer w0.254: D2.2 v1(58.87,41.84) v1(59.63,41.84) v1(60.39,41.84) 60.78,41.84 Q5.9 ; D3.2 51.85,23.27 52.07,23.04 52.07,19.58 arc(52.03,19.39) 51.92,19.22 v1(51.68,18.98)
  Top Layer w0.5: R34.1 56.78,57.95 57.66,57.08 57.66,43.62 ; v1(30.81,20.38) 30.76,20.42 D1.2
  Top Layer w2: CN2.2 62.19,16.65 63.09,17.55 C13.1
  Inner1 w3: v1(66.07,43.36) v1(66.07,42.54) v1(66.07,41.7) v1(66.07,40.8) 66.07,39.94 arc(66.14,39.56) 66.36,39.23 70.06,35.53 arc(70.28,35.2) 70.36,34.82 70.36,24.35 arc(70.28,23.96) 70.06,23.64 68.24,21.81 arc(67.91,21.6) 67.53,21.52 59.44,21.52 ; v1(20.2,41.71) v1(19.43,41.71) v1(18.66,41.71) v1(17.74,41.71) 11.81,41.71 9.78,39.68 9.78,22.41 11.79,20.39 20.32,20.39 ; v1(51.68,19.74) v1(51.68,18.98) v1(51.68,18.22) v1(51.68,17.46) 51.68,11.38 arc(51.6,11) 51.39,10.68 50.08,9.37 arc(49.75,9.15) 49.37,9.07 31.28,9.07 arc(30.89,9.15) 30.57,9.37 30.14,9.8 arc(29.92,10.12) 29.84,10.5 29.84,19.43
  vias: v1(17.36,21.74) v1(17.36,20.98) v1(17.36,20.21) v1(17.74,42.51) v1(17.78,40.95) v1(18.14,21.74) v1(18.14,20.98) v1(18.14,20.21) v1(18.64,42.51) v1(18.67,40.95) v1(18.91,21.74) v1(18.91,20.98) v1(18.91,20.21) v1(19.41,42.51) v1(19.41,40.95) v1(19.69,21.74) v1(19.69,20.98) v1(19.69,20.21) v1(20.17,42.51) v1(20.17,40.95) v1(20.47,21.74) v1(20.47,20.98) v1(20.47,20.21) v1(20.94,40.95) v1(20.97,42.51) v1(20.97,41.71) v1(21.25,21.74) v1(21.25,20.98) v1(21.25,20.21) v1(29.25,20.38) v1(29.25,19.61) v1(29.25,18.85) v1(29.25,18.09) v1(29.25,17.33) v1(30.03,20.38) v1(30.03,19.61) v1(30.03,18.85) v1(30.03,18.09) v1(30.03,17.33) v1(30.81,19.61) v1(30.81,18.85) v1(30.81,18.09) v1(30.81,17.33) v1(50.9,20.5) v1(50.9,19.74) v1(50.9,18.98) v1(50.9,18.22) v1(50.9,17.46) v1(51.68,20.5) v1(52.46,20.5) v1(52.46,19.74) v1(52.46,18.98) v1(52.46,18.22) v1(52.46,17.46) v1(58.87,42.62) v1(58.87,41.06) v1(59.03,22.92) v1(59.03,22.14) v1(59.03,21.36) v1(59.63,42.62) v1(59.63,41.06) v1(59.79,22.92) v1(59.79,22.14) v1(59.79,21.36) v1(60.39,42.62) v1(60.39,41.06) v1(60.56,22.92) v1(60.56,22.14) v1(60.56,21.36) v1(61.16,42.62) v1(61.16,41.84) v1(61.16,41.06) v1(61.32,22.92) v1(61.32,22.14) v1(61.32,21.36) v1(61.92,42.62) v1(61.92,41.84) v1(61.92,41.06) v1(62.08,22.92) v1(62.08,22.14) v1(62.08,21.36) v1(62.68,42.62) v1(62.68,41.84) v1(62.68,41.06) v1(62.84,22.92) v1(62.84,22.14) v1(62.84,21.36) v1(65.28,43.36) v1(65.25,42.54) v1(65.28,41.71) v1(65.28,40.8) v1(66.89,43.36) v1(66.89,42.54) v1(66.88,41.7) v1(66.88,40.85)
BA: length 18.7
  Top Layer w0.254: Q9.1 48.46,20.5
  Top Layer w0.3: B.23 41.66,23.25 arc(41.67,23.18) 41.71,23.11 42.23,22.59 arc(42.3,22.55) 42.37,22.53 48.12,22.53 arc(48.2,22.52) 48.26,22.48 48.4,22.34 arc(48.44,22.27) 48.46,22.2 Q9.1
  Bottom Layer w0.5: C91.2 42.78,8.04 44.28,9.54 CN5.2
  vias: v1(42.29,19.18) v1(42.29,18.4) v1(42.29,17.62) v1(43.05,19.18) v1(43.05,18.4) v1(43.05,17.62) v1(43.81,19.18) v1(43.81,18.4) v1(43.81,17.62) v1(44.58,19.18) v1(44.58,18.4) v1(44.58,17.62) v1(45.34,19.18) v1(45.34,18.4) v1(45.34,17.62)
BB: length 19.5
  Top Layer w0.3: B.18 35,24.69 arc(34.81,24.66) 34.65,24.55 34.31,24.21 arc(34.2,24.04) 34.16,23.85 34.16,19.49 ; Q11.3 34.16,19.49
  Bottom Layer w0.5: C91.1 40.78,8.17 39.28,9.67 CN5.1
  vias: v1(33.27,14.8) v1(33.27,14.03) v1(33.27,13.25) v1(33.27,12.39) v1(33.27,11.61) v1(34.04,14.8) v1(34.04,14.03) v1(34.04,13.25) v1(34.04,12.39) v1(34.04,11.61) v1(34.8,14.8) v1(34.8,14.03) v1(34.8,13.25) v1(34.8,12.39) v1(34.8,11.61) v1(35.56,14.8) v1(35.56,14.03) v1(35.56,13.25) v1(35.56,12.39) v1(35.56,11.61) v1(35.81,19.05) v1(35.81,18.28) v1(35.81,17.5) v1(36.32,14.8) v1(36.32,14.03) v1(36.32,13.25) v1(36.32,12.39) v1(36.32,11.61) v1(36.58,19.05) v1(36.58,18.28) v1(36.58,17.5) v1(37.34,19.05) v1(37.34,18.28) v1(37.34,17.5) v1(38.1,19.05) v1(38.1,18.28) v1(38.1,17.5) v1(38.86,19.05) v1(38.86,18.28) v1(38.86,17.5)
EN: length 119
  Top Layer w0.3: 28.57,34.89 28.57,36.35 28.6,36.38 arc(28.62,36.45) 28.66,36.52 28.97,36.83 arc(29.04,36.87) 29.11,36.89 38.27,36.89 arc(38.35,36.87) 38.41,36.83 38.68,36.57 arc(38.72,36.5) 38.74,36.42 v1(38.74,36.27) ; R32.1 45.48,58.08 v1(45.47,58.09) ; v1(38.68,34.4) 36.54,34.4 arc(36.5,34.39) 36.47,34.37 36.1,33.99 arc(36.08,33.96) 36.07,33.92 36.07,27.4 arc(36.08,27.36) 36.1,27.33 36.17,27.26 arc(36.2,27.24) 36.24,27.23 B.13 ; v1(42.67,36.25) 44.45,36.25 45.09,35.62 45.09,31.15 45.44,30.79 49.24,30.79 49.49,30.54 R.13
  Inner1 w0.254: v1(38.68,34.4) 38.68,30.23 38.1,29.65 35.18,29.65 34.8,29.27 34.8,23.04 34.04,22.28 26.54,22.28 25.35,21.09 25.35,14.74 24.76,14.15 6.6,14.15 6.35,14.41
  Inner1 w0.3: v1(38.68,34.4) 38.74,34.45 v1(38.74,36.27) 42.65,36.27 v1(42.67,36.25) 42.67,57.08 43.69,58.09 v1(45.47,58.09)
EN_B: length 28.3
  Top Layer w0.254: B.14 35.73,26.73 arc(35.69,26.73) 35.66,26.76 35.59,26.82 arc(35.57,26.86) 35.56,26.89 35.56,34.24 arc(35.6,34.43) 35.71,34.59 35.95,34.83 arc(36.11,34.94) 36.3,34.98 40.18,34.98 arc(40.37,35.02) 40.53,35.13 40.75,35.34 arc(40.86,35.5) 40.89,35.7 40.89,44.65 arc(40.9,44.69) 40.92,44.72 41.12,44.91 arc(41.15,44.94) 41.19,44.94 U43.15
EN_IN_B: length 53.3
  Top Layer w0.254: R45.2 v1(32.89,45.52) 32.97,45.59 U43.5
  Bottom Layer w0.254: v1(32.89,45.52) 32.89,50.6 33.4,51.11 64.64,51.11 65.15,51.62 65.15,55.94 64.77,56.32 64.19,56.32 64.01,56.5 64.01,56.57
L_EN_F: length 25.9
  Top Layer w0.254: 28.09,34.86 28.09,36.83 arc(28.13,37.03) 28.24,37.19 28.27,37.22 arc(28.44,37.33) 28.63,37.37 39.13,37.37 arc(39.32,37.4) 39.48,37.51 39.73,37.76 arc(39.84,37.92) 39.88,38.11 39.88,45.96 arc(39.89,46) 39.91,46.03 40.09,46.21 arc(40.12,46.24) 40.16,46.24 U43.17
L_EN_IN_F: length 58.2
  Top Layer w0.254: U43.3 29.82,46.89 29.65,46.73 v1(29.65,45.98) R48.2
  Bottom Layer w0.254: U15.2 62.36,56.44 62.61,56.19 62.61,52.76 62.36,52.51 30.1,52.51 29.65,52.06 v1(29.65,45.98)
L_FA: length 21.8
  Top Layer w0.254: 21.08,23.78 21.11,23.81 23.24,23.81 23.82,24.39 23.82,31.75 24.01,31.94 25.17,31.94
  Bottom Layer w0.254: CN3.2 13.34,29.14 4.95,29.14 4.83,29.27 C89.2
  vias: v1(18.41,29.88) v1(18.41,29.1) v1(18.41,28.33) v1(18.41,27.55) v1(18.41,26.77) v1(18.41,25.99) v1(19.18,29.88) v1(19.18,29.1) v1(19.18,28.33) v1(19.18,27.55) v1(19.18,26.77) v1(19.18,25.99) v1(19.94,29.88) v1(19.94,29.1) v1(19.94,28.33) v1(19.94,27.55) v1(19.94,26.77) v1(19.94,25.99)
L_FB: length 18.4
  Top Layer w0.254: 20.07,37.65 25.78,37.65 26.03,37.39 L.18
  Bottom Layer w0.254: C89.1 4.83,33.71 5.21,34.09 13.3,34.09 CN3.1
  vias: v1(18.26,36.02) v1(18.26,35.25) v1(18.26,34.49) v1(18.36,33.77) v1(18.36,33.08) v1(19.12,36.03) v1(19.12,35.27) v1(19.12,34.5) v1(19.12,33.77) v1(19.12,33.08) v1(19.94,36) v1(19.94,35.23) v1(19.94,34.47) v1(19.88,33.77) v1(19.88,33.08)
L_PH_F: length 27.1
  Top Layer w0.254: U43.18 39.93,46.89 arc(39.74,46.85) 39.58,46.75 39.52,46.68 arc(39.41,46.52) 39.37,46.33 39.37,38.07 arc(39.36,38.03) 39.34,38 39.15,37.8 arc(39.11,37.78) 39.07,37.78 28.3,37.78 arc(28.11,37.74) 27.94,37.63 27.73,37.42 arc(27.63,37.26) 27.59,37.07 27.59,34.86
L_PH_IN_F: length 56.8
  Top Layer w0.254: U43.2 28.82,47.54 28.07,46.79 v1(28.07,46.21) R49.2
  Bottom Layer w0.254: U15.1 28.83,53.9 28.07,53.14 v1(28.07,46.21)
PH_B: length 30.3
  Top Layer w0.254: U43.16 40.71,45.59 arc(40.67,45.59) 40.64,45.56 40.42,45.34 arc(40.39,45.31) 40.39,45.27 40.39,36.08 arc(40.35,35.89) 40.24,35.72 40.15,35.64 arc(39.99,35.53) 39.8,35.49 35.89,35.49 arc(35.7,35.45) 35.54,35.34 35.15,34.95 arc(35.04,34.79) 35,34.59 35,26.81 arc(35.04,26.61) 35.15,26.45 35.23,26.36 arc(35.4,26.26) 35.59,26.22 B.15
PH_IN_B: length 51.7
  Top Layer w0.254: U43.4 37.57,46.17 37.16,46.17 37.13,46.2 36.45,46.2 36.42,46.17 v1(31.43,46.17) 31.43,40.69 R47.2
  Bottom Layer w0.254: v1(31.43,46.17) 31.5,46.23 31.5,51.24 32,51.75 63.63,51.75 64.01,52.13 U15.3
R_EN_F: length 25.3
  Top Layer w0.254: U43.13 42.1,43.64 arc(42.07,43.64) 42.03,43.61 41.94,43.52 arc(41.92,43.49) 41.91,43.45 41.91,36.13 arc(41.95,35.94) 42.06,35.77 42.1,35.73 arc(42.27,35.62) 42.46,35.58 44.13,35.58 arc(44.32,35.54) 44.48,35.43 44.53,35.38 arc(44.64,35.22) 44.68,35.03 44.68,30.73 arc(44.69,30.69) 44.71,30.66 44.93,30.44 arc(44.96,30.42) 45,30.41 48.73,30.41 arc(48.77,30.4) 48.8,30.38 49,30.18 arc(49.02,30.15) 49.03,30.11 49.03,29.34 arc(49.07,29.15) 49.18,28.99 49.21,28.95 arc(49.37,28.85) 49.56,28.81 50.17,28.81 arc(50.21,28.82) 50.24,28.84 50.39,28.98 arc(50.41,29.02) 50.42,29.05 50.42,30.38 50.42,30.38 R.14
R_EN_IN_F: length 49.5
  Top Layer w0.254: R44.2 v1(36.19,44.31) 36.48,44.31 36.49,44.29 U43.7
  Bottom Layer w0.254: v1(36.19,44.31) 36.19,49.71 36.58,50.09 67.18,50.09 67.82,50.73 67.82,56.19 67.56,56.44 U15.6
R_FA: length 13.5
  Top Layer w0.254: Q5.1 58.9,38.54 55.75,38.54 55.37,38.16 55.37,33.71 55.12,33.46 R.23
  Bottom Layer w0.254: C90.2 75.31,34.22 75.06,34.47 v1(73.8,34.47)
  vias: v1(60.21,36.75) v1(60.21,35.99) v1(60.21,35.23) v1(60.21,34.47) v1(60.21,33.7) v1(60.21,32.94) v1(60.99,36.75) v1(60.99,35.99) v1(60.99,35.23) v1(60.99,34.47) v1(60.99,33.7) v1(60.99,32.94) v1(61.76,36.75) v1(61.76,35.99) v1(61.76,35.23) v1(61.76,34.47) v1(61.76,33.7) v1(61.76,32.94) v1(73.03,36.76) v1(73.03,36) v1(73.03,35.23) v1(73.03,34.47) v1(73.03,33.71) v1(73.03,32.95) v1(73.8,36.76) v1(73.8,36) v1(73.8,35.23) v1(73.8,33.71) v1(73.8,32.95)
R_FB: length 16.2
  Top Layer w0.254: Q6.3 60.38,25.2 60.38,25.78 60.2,25.96 53.09,25.96 52.45,26.6 R.18
  Bottom Layer w0.254: v1(73.8,28.76) 75.06,28.76 75.31,29.01 C90.1
  vias: v1(60.12,30.79) v1(60.12,30.03) v1(60.12,29.27) v1(60.12,28.5) v1(60.12,27.74) v1(60.12,26.98) v1(60.9,30.79) v1(60.9,30.03) v1(60.9,29.27) v1(60.9,28.5) v1(60.9,27.74) v1(60.9,26.98) v1(61.68,30.79) v1(61.68,30.03) v1(61.68,29.27) v1(61.68,28.5) v1(61.68,27.74) v1(61.68,26.98) v1(73.03,31.04) v1(73.03,30.28) v1(73.03,29.52) v1(73.03,28.76) v1(73.03,28) v1(73.03,27.23) v1(73.8,31.04) v1(73.8,30.28) v1(73.8,29.52) v1(73.8,28) v1(73.8,27.23)
R_PH_F: length 28.1
  Top Layer w0.254: R.15 50.93,30.53 50.93,28.67 arc(50.92,28.63) 50.9,28.6 50.78,28.48 arc(50.74,28.46) 50.71,28.45 49.28,28.45 arc(49.09,28.49) 48.93,28.6 48.82,28.71 arc(48.71,28.87) 48.67,29.06 48.67,29.81 arc(48.67,29.85) 48.64,29.88 48.52,30 arc(48.49,30.02) 48.45,30.03 44.91,30.03 arc(44.72,30.07) 44.56,30.17 44.47,30.26 arc(44.36,30.42) 44.32,30.62 44.32,34.69 arc(44.32,34.72) 44.29,34.76 44.1,34.95 arc(44.07,34.97) 44.03,34.98 42.12,34.98 arc(41.93,35.02) 41.76,35.13 41.55,35.34 arc(41.44,35.5) 41.4,35.7 41.4,44.08 arc(41.41,44.12) 41.43,44.15 41.54,44.26 arc(41.57,44.29) 41.61,44.29 U43.14
R_PH_IN_F: length 47.5
  Top Layer w0.254: U43.6 34.56,44.94 v1(34.54,44.96) R46.2
  Bottom Layer w0.254: v1(34.54,44.96) 34.54,49.71 35.43,50.6 65.79,50.6 66.55,51.36 U15.5
$1N4660: length 5.3
  Top Layer w0.254: 25.17,32.44 23.72,32.44 23.47,32.19 23.47,30 23.31,29.84 22.27,29.84
$1N4661: length 19.3
  Top Layer w0.254: Q1.4 17.38,23.81 v1(15.24,23.81) ; v1(24.41,25.08) 24.46,25.14 24.46,31.18 24.71,31.43 25.17,31.43
  Bottom Layer w0.254: v1(24.41,25.08) 24.15,24.82 15.37,24.82 15.24,24.69 v1(15.24,23.81)
$1N4662: length 2.2
  Top Layer w0.254: 26.57,30.54 26.57,29.49 26.8,29.27 26.8,28.69 C48.2
$1N4663: length 4.1
  Top Layer w0.254: 27.59,30.54 27.59,29.75 27.69,29.65 29.59,29.65 29.91,29.33 C47.2
$1N4675: length 10.5
  Top Layer w0.254: v1(29.46,34.6) 29.49,34.57 29.49,33.97 ; 28.6,30.54 28.63,30.57 v1(29.33,30.57) 29.59,30.83 29.59,31.33 29.49,31.43 30.48,31.43 30.61,31.55 31.69,31.55 C51.1
  Bottom Layer w0.254: v1(29.33,30.57) 30.13,30.57 30.35,30.79 30.35,34.47 30.17,34.65 29.52,34.65 v1(29.46,34.6)
$1N4676: length 3.2
  Top Layer w0.254: C47.1 28.51,29.1 28.32,29.29 27.39,29.29 27.05,29.63 27.05,30.51 27.08,30.54
$1N4680: length 5
  Top Layer w0.254: Q4.4 23.92,36.5 24.18,36.25 24.18,34.3 24.51,33.97 25.17,33.97
$1N4681: length 8.9
  Top Layer w0.254: 26.57,34.86 26.54,34.89 26.54,38.41 26.25,38.71 Q2.4
$1N4684: length 3
  Top Layer w0.254: R.2 51.95,36.64 52.26,36.95 C7.2
$1N4685: length 4.6
  Top Layer w0.254: 48.96,37.78 48.96,36.82 49.28,36.5 50.8,36.5 50.93,36.38 R.4
$1N4694: length 10.4
  Top Layer w0.254: R.12 49.02,31.42 v1(48.01,31.42) ; 45.85,34.66 46.67,34.66 47.37,33.97 R.7 48.97,34.02 v1(48.97,34.68) 49.15,34.86 R.6
  Bottom Layer w0.254: v1(48.01,31.42) 48.01,34.6 48.08,34.68 v1(48.97,34.68)
$1N4695: length 3.8
  Top Layer w0.254: C53.1 50.36,37.08 50.57,36.86 51.33,36.86 51.44,36.76 R.3
$1N4699: length 8.6
  Top Layer w0.254: R.19 55.37,31.43 55.5,31.3 55.5,27.23 55.75,26.98 Q8.4
$1N4700: length 12.1
  Top Layer w0.254: Q6.4 52.65,25.13 51.95,25.83 R.17
$1N4703: length 3.4
  Top Layer w0.254: R.8 47.25,33.46 46.67,32.88 45.85,32.88
$1N4708: length 2.5
  Top Layer w0.3: Q10.4 41.91,22.07 arc(41.9,22.15) 41.85,22.21 41.21,22.86 arc(41.16,22.92) 41.15,23 B.22
$1N4709: length 18.1
  Top Layer w0.254: Q9.4 48.46,16.08 v1(48.39,16.01)
  Top Layer w0.3: v1(49.32,22.23) 49.32,22.66 arc(49.31,22.74) 49.26,22.8 49.11,22.96 arc(49.04,23) 48.96,23.02 42.53,23.02 arc(42.45,23.03) 42.38,23.08 42.22,23.24 arc(42.18,23.3) 42.16,23.38 B.24
  Bottom Layer w0.254: v1(49.32,22.23) 47.83,22.23 47.5,21.9 47.5,16.19 47.68,16.01 v1(48.39,16.01)
$1N4710: length 3.1
  Top Layer w0.254: B.2 44.83,25.2 45.15,25.52 45.85,25.52 45.97,25.39
$1N4711: length 5.2
  Top Layer w0.254: C58.2 44.58,28.7 44.32,28.44 44.32,26.34 44.2,26.22 B.4
$1N4721: length 3.7
  Top Layer w0.254: B.8 41.66,29.52 41.53,29.65 40.39,29.65 40.21,29.83 40.21,30.53 C63.1
$1N4722: length 11
  Top Layer w0.254: C62.1 42.16,30.47 B.7 42.8,28.12 43.05,27.87 B.6 ; B.12 v1(38.61,28.12)
  Bottom Layer w0.254: v1(42.89,27.96) 42.89,28.66 42.54,29.01 38.86,29.01 38.61,28.76 v1(38.61,28.12)
$1N4723: length 4.2
  Top Layer w0.254: B.3 44.32,25.71 44.7,26.09 44.7,27.11 44.89,27.3 C58.1
$1N4727: length 6.2
  Top Layer w0.3: B.19 36.15,23.81 arc(35.96,23.77) 35.79,23.66 35.58,23.44 arc(35.47,23.28) 35.43,23.09 35.43,21.5
$1N4728: length 9.8
  Top Layer w0.3: Q11.4 33.25,24.84 arc(33.27,24.92) 33.31,24.98 33.47,25.14 arc(33.53,25.19) 33.61,25.2 B.17
$1N4802: length 18.1
  Top Layer w0.254: Q5.4 62.79,38.51 v1(63.68,38.51) ; R.24 54.74,33.97 54.86,34.09 54.86,38.79 v1(55.42,39.34)
  Bottom Layer w0.254: v1(63.68,38.51) 63.68,38.08 63.37,37.78 57.66,37.78 57.4,38.03 57.4,39.05 57.1,39.34 v1(55.42,39.34)
$1N4803: length 4.5
  Top Layer w0.254: 57.77,32.81 57.63,32.95 R.22
$1N4806: length 2.2
  Top Layer w0.254: R32.2 EN1.2
$1N4831: length 10.4
  Top Layer w0.254: D3.1 49.18,25.87 48.83,25.52 C94.2 47.82,25.58 ; 47.82,27.23 47.82,25.58 ; 47.82,25.58 47.17,25.58 46.86,25.28 46.86,24.31 46.67,24.12 C59.1 ; B.1 44.83,24.69 45.53,23.99 45.97,23.99
$1N4840: length 10
  Top Layer w0.254: D1.1 28.16,25.68 28.57,26.08 C96.2 28.54,26.6 C95.2 26.6,26.61 26.6,27.56 26.42,27.74 25.27,27.74 25.21,27.81 C48.1 25.21,29.45 25.4,29.65 25.91,29.65 26.06,29.8 26.06,30.54
$1N4841: length 11.1
  Top Layer w0.254: C54.2 C55.2 ; C55.2 52.26,38.98 52.45,38.79 53.41,38.79 53.59,38.61 53.59,37.84 C7.1 53.59,37.71 53.59,36.81 53.41,36.63 52.71,36.63 52.45,36.38 R.1 ; C55.2 52.2,39.74 52.2,40.95 51.79,41.36 D2.1
$1N5410: length 2.1
  Top Layer w0.254: 50.04,55.96 PRW.2

## Copper pours and planes (outline as drawn; the poured copper is in the pictures)
GND on Top Layer: -4.32,61.78 94.74,61.78 94.74,-2.74 -4.32,-2.74
GND on Bottom Layer: -2.41,64.19 86.11,64.19 86.11,-1.47 -2.41,-1.47
GND on Inner1: -0.64,61.91 83.19,61.91 83.19,-6.04 -0.64,-6.04
GND on Inner2: -5.59,62.79 92.58,62.79 92.58,-7.94 -5.59,-7.94
VIN on Top Layer: 49.66,23.55 75.44,23.55 75.44,10.47 49.66,10.47
VIN on Top Layer: 14.35,22.28 32.13,22.28 32.13,14.28 14.35,14.28
VIN on Top Layer: 57.4,44.89 67.82,44.89 67.82,40.19 57.4,40.19
BA on Top Layer: 41.31,21.48 49.02,21.48 49.02,9.84 41.31,9.84
BB on Top Layer: 32.64,20.63 40.77,20.63 40.77,9.84 32.64,9.84
L_FA on Top Layer: 18.03,25.96 21.34,25.96 21.34,23.3 18.03,23.3
L_FA on Top Layer: 8,30.79 21.34,30.79 21.34,25.33 8,25.33
L_FB on Top Layer: 8,39.43 20.7,39.43 20.7,32.44 8,32.44
R_FA on Top Layer: 58.67,39.17 74.56,39.17 74.56,32.06 58.67,32.06
R_FB on Top Layer: 58.64,31.68 74.55,31.68 74.55,24.31 58.64,24.31

Small or netless copper shapes (teardrops, artwork), in the pictures only: 247 on Top Layer, 38 on Bottom Layer, 12 on Inner1

## Text on the board
Top Layer: 2025.7.2 | 陕西科技大学 | 幻影队
Top Solder Mask Layer: 2025.7.2 | 陕西科技大学 | 幻影队
Top Silkscreen Layer: EN3 | PH3 | EN2 | PH2 | PH1 | EN1 | GND | - | + | 开 | 关
